# Altium schematic sheet Rectifier.SchDoc
size A4; SheetNumber: 2; SheetTotal: 3
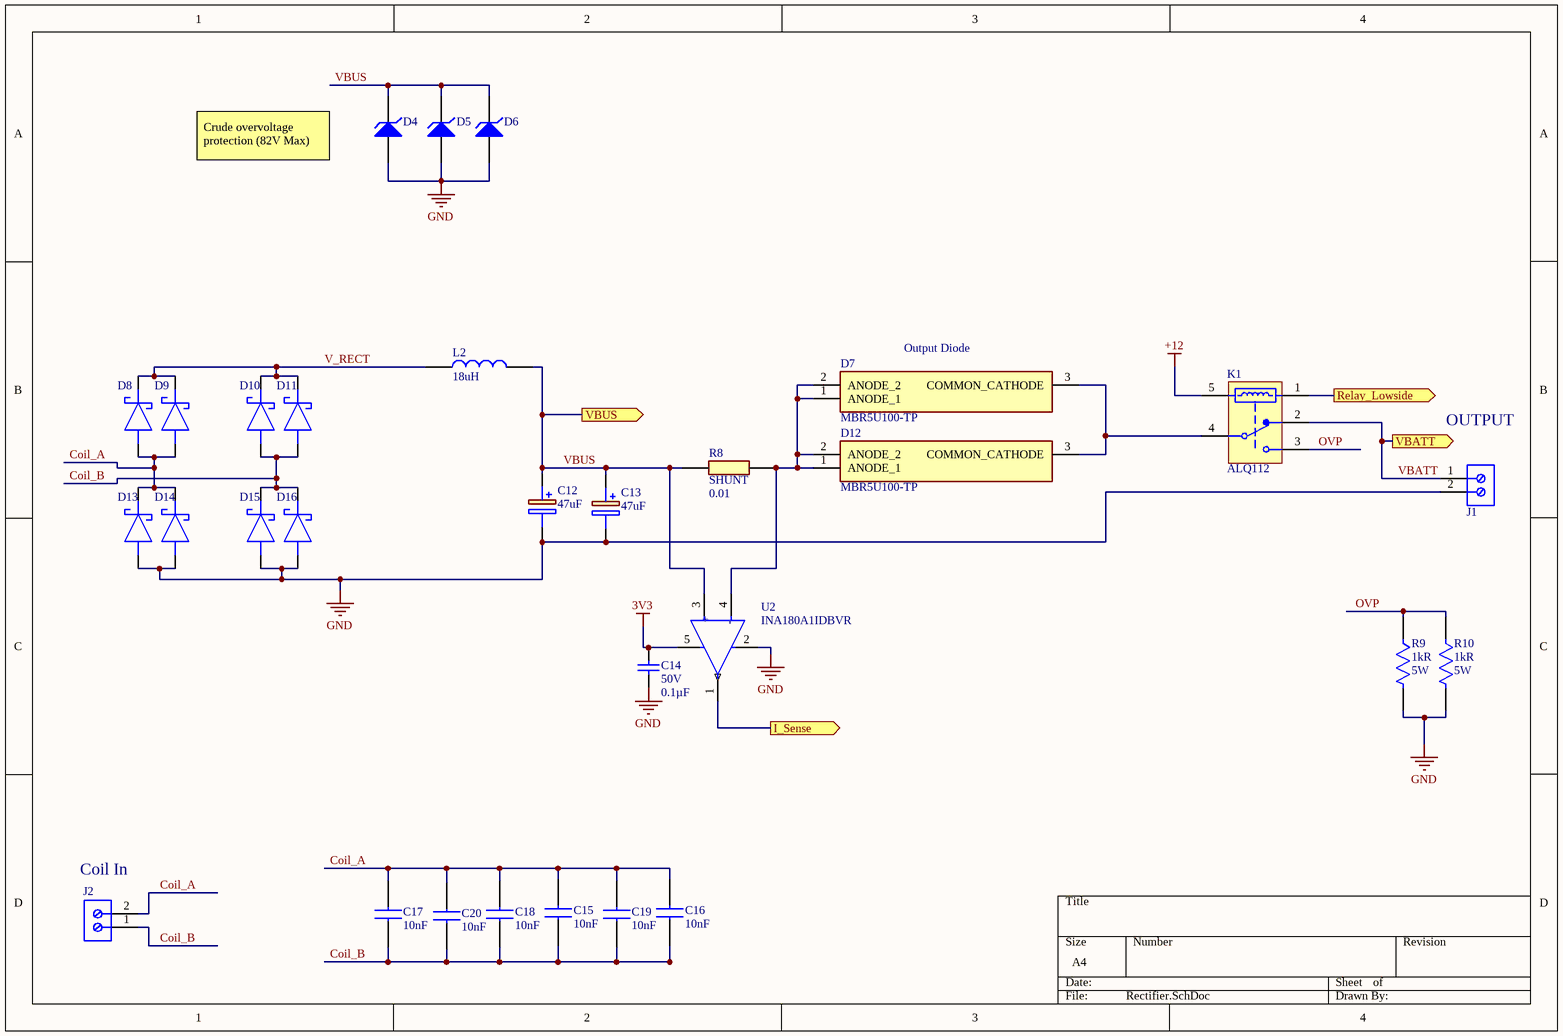
[diagram p0: Rectifier.SchDoc]

## Parts
C12  Capacitance: 47uF  [CAPAE1030X1080N]  (hidden comment: UCD1K470MNL1GS)
C13  Capacitance: 47uF  [CAPAE1030X1080N]  (hidden comment: UCD1K470MNL1GS)
C14  Voltage - Rated: 50V  Capacitance: 0.1µF  [CAP0805]  (hidden comment: C0805C104K5RACTU)
C15  Capacitance: 10nF  [CAPC3216X110N]  (hidden comment: C1206C103JAGECAUTO)
C16  Capacitance: 10nF  [CAPC3216X110N]  (hidden comment: C1206C103JAGECAUTO)
C17  Capacitance: 10nF  [CAPC3216X110N]  (hidden comment: C1206C103JAGECAUTO)
C18  Capacitance: 10nF  [CAPC3216X110N]  (hidden comment: C1206C103JAGECAUTO)
C19  Capacitance: 10nF  [CAPC3216X110N]  (hidden comment: C1206C103JAGECAUTO)
C20  Capacitance: 10nF  [CAPC3216X110N]  (hidden comment: C1206C103JAGECAUTO)
D4  1SMB5947BT3G  [ONSC-SMB-2-403A-03_H_V]  (value not drawn)
D5  1SMB5947BT3G  [ONSC-SMB-2-403A-03_H_V]  (value not drawn)
D6  1SMB5947BT3G  [ONSC-SMB-2-403A-03_H_V]  (value not drawn)
D7  MBR5U100-TP  [MBR5U100TP]
D8  STPS4S200UFN  [SODFL5436X110N]  (value not drawn)
D9  STPS4S200UFN  [SODFL5436X110N]  (value not drawn)
D10  STPS4S200UFN  [SODFL5436X110N]  (value not drawn)
D11  STPS4S200UFN  [SODFL5436X110N]  (value not drawn)
D12  MBR5U100-TP  [MBR5U100TP]
D13  STPS4S200UFN  [SODFL5436X110N]  (value not drawn)
D14  STPS4S200UFN  [SODFL5436X110N]  (value not drawn)
D15  STPS4S200UFN  [SODFL5436X110N]  (value not drawn)
D16  STPS4S200UFN  [SODFL5436X110N]  (value not drawn)
J1  691137710002  [691137710002]  (value not drawn)
J2  691137710002  [691137710002]  (value not drawn)
K1  ALQ112  [PNSC-LQ-5-2000x1000x1600_V]
L2  Inductance: 18uH  [SDR1307-220ML]  (hidden comment: SDR1307-180ML)
R8  SHUNT  Resistance: 0.01  [RESC6434X90N]
R9  Resistance: 1kR  Max Power Dissipation: 5W  [FP-SMF5-MFG]  (hidden comment: SMF51K0JT)
R10  Resistance: 1kR  Max Power Dissipation: 5W  [FP-SMF5-MFG]  (hidden comment: SMF51K0JT)
U2  INA180A1IDBVR  [FP-DBV0005A-IPC_A]

## Ports
I_Sense (out), Relay_Lowside (out), VBATT (out), VBUS (out)

## Nets
3V3: C14.2 U2.5(VS)
+12: K1.5
GND: C12.2(-) C13.2(-) C14.1 D4.2(A) D5.2(A) D6.2(A) D13.2(A) D14.2(A) D15.2(A) D16.2(A) J1.2 R9.2 R10.2 U2.2(GND)
Coil_A: C15.1 C16.1 C17.1 C18.1 C19.1 C20.1 D8.2(A) D9.2(A) D13.1(K) D14.1(K) J2.2
Coil_B: C15.2 C16.2 C17.2 C18.2 C19.2 C20.2 D10.2(A) D11.2(A) D15.1(K) D16.1(K) J2.1
I_Sense: U2.1(OUT) ; port I_Sense
OVP: K1.3(NO) R9.1 R10.1
Relay_Lowside: K1.1 ; port Relay_Lowside
V_RECT: D8.1(K) D9.1(K) D10.1(K) D11.1(K) L2.1
VBATT: J1.1 K1.2(NC) ; port VBATT
VBUS: C12.1(+) C13.1(+) D4.1(K) D5.1(K) D6.1(K) L2.2 R8.1 U2.3(IN+) ; port VBUS
NetD7_1: D7.1(ANODE_1) D7.2(ANODE_2) D12.1(ANODE_1) D12.2(ANODE_2) R8.2 U2.4(IN-)
NetD7_3: D7.3(COMMON_CATHODE) D12.3(COMMON_CATHODE) K1.4(COM)

## Notes on the sheet
- Crude overvoltage protection (82V Max)
- (near D7) Output Diode
- (near J1) OUTPUT
- (near J2) Coil In
- (in symbol CMP-04895-000140-1) +; -

## Library data of the parts
C12 C13 = UCD1K470MNL1GS: Capacitor Polarised; Manufacturer_Name: Nichicon; Datasheet Link: https://www.arrow.com/en/products/ucd1k470mnl1gs/nichicon; Height: 10.8mm; Manufacturer_Part_Number: UCD1K470MNL1GS; Mouser Part Number: 647-UCD1K470MNL1GS; Mouser Price/Stock: https://www.mouser.co.uk/ProductDetail/Nichicon/UCD1K470MNL1GS?qs=c0uEScvPYN07T8BStUenxw%3D%3D; Arrow Part Number: UCD1K470MNL1GS; Arrow Price/Stock: https://www.arrow.com/en/products/ucd1k470mnl1gs/nichicon
C14 = C0805C104K5RACTU: CAP CER 0.1UF 50V X7R 0805; Tolerance: ±10%; Supplier 1: Digi-Key; Supplier Part Number 1: 399-1170-1-ND; Temperature Coefficient: X7R; Package / Case: 0805
C15-C20 = C1206C103JAGECAUTO: Capacitor; Manufacturer_Name: KEMET; Datasheet Link: https://content.kemet.com/datasheets/KEM_C1091_C0G_ESD.pdf; Height: 1.1mm; Manufacturer_Part_Number: C1206C103JAGECAUTO; Mouser Part Number: 80-C1206C103JAGECAUT; Mouser Price/Stock: https://www.mouser.co.uk/ProductDetail/KEMET/C1206C103JAGECAUTO?qs=MLItCLRbWsxJM3Q8yxQv7A%3D%3D; Arrow Part Number: C1206C103JAGECAUTO; Arrow Price/Stock: https://www.arrow.com/en/products/c1206c103jagecauto/kemet-corporation?region=nac
D4-D6 = CMP-1060-00168-1: 3 W Zener Voltage Regulator, 2-Pin SMB, Pb-Free, Tape and Reel; Manufacturer: On Semiconductor; VZ Typ (V): 82; Mounting Technology: Surface Mount; ComponentLink1URL: http://www.onsemi.com/; ComponentLink2Description: Datasheet; PackageDescription: 2-Pin Small Molded Package, J-Bend Lead, Body 4.33 x 3.625 mm; ComponentLink3URL: http://www.onsemi.com/pub_link/Collateral/1SMB5913BT3-D.PDF; DatasheetVersion: Rev. 8; ComponentLink2URL: http://www.onsemi.com/pub_link/Collateral/1SMB5913BT3-D.PDF; PackageReference: SMB-2-403A-03_H; PartNumber: 1SMB5947BT3G; RoHS: Pb-Free; PackageVersion: Rev. H, 05/2011; ComponentLink3Description: Package Specification; ComponentLink1Description: Manufacturer URL; Packing: Tape and Reel
D7 D12 = MBR5U100-TP: Schottky Diode; Manufacturer_Name: Micro Commercial Components (MCC); Datasheet Link: https://www.mccsemi.com/pdf/Products/MBR5U100(TO-277).pdf; Height: 1.2mm; Manufacturer_Part_Number: MBR5U100-TP
D8-D11 D13-D16 = STPS4S200UFN: Schottky Diode; Manufacturer_Name: STMicroelectronics; Datasheet Link: https://www.st.com/resource/en/datasheet/stps4s200.pdf; Height: 1.1mm; Manufacturer_Part_Number: STPS4S200UFN; Mouser Part Number: 511-STPS4S200UFN; Mouser Price/Stock: https://www.mouser.co.uk/ProductDetail/STMicroelectronics/STPS4S200UFN?qs=xZ%2FP%252Ba9zWqZ%2F%2FCgto3MYYA%3D%3D; Arrow Part Number: STPS4S200UFN; Arrow Price/Stock: https://www.arrow.com/en/products/stps4s200ufn/stmicroelectronics?region=europe
J1 J2 = CMP-1502-03324-1: Series 1377 - 5.00 mm Horizontal Entry with Pressure Clamp WR-TBL, 2 pin; Manufacturer: Wurth Elektronik; Pin Number: 2; Pitch: 5.00mm; Operating Temperature: -30to120degC; Package Reference: 691137710002; Publisher: WurthElektronik; Mounting Technology: THT; Manufacturer URL: http://www.we-online.de; Packaging: Box; Part Number: 691137710002; Datasheet URL: http://katalog.we-online.de/pbs/datasheet/691137710002.pdf
K1 = CMP-1503-00193-1: LQ Relays, 12 V Coil Voltage, 400 mW Nominal Operating Power, -40 to 85 degC, 5-Pin LQ, Carton, Case, RoHS; Manufacturer: Panasonic; Pb-Free: True; Max Switching Current: 10 A (N.O.), 3 A (N.C.); Electrical Life: 5x10^4; Coil Voltage: 12 V; Max Switching Voltage: 250 V AC; Nominal Operating Power: 400 mW; Mechanical Life(Min.operation): 1x10^7; Packing: Carton, Case; ComponentLink3URL: http://www3.panasonic.biz/ac/e_download/control/relay/power/catalog/mech_eng_lq.pdf?f_cd=401220; ComponentLink1URL: http://www3.panasonic.biz/ac/ae/index.jsp; ComponentLink1Description: Manufacturer URL; Series: LQ Relays; RoHS: True; PackageReference: LQ-5-2000x1000x1600; DatasheetVersion: 201410-T; ComponentLink2Description: Datasheet; ComponentLink2URL: http://www3.panasonic.biz/ac/e_download/control/relay/power/catalog/mech_eng_lq.pdf?f_cd=401220; PackageDescription: 5-Pin Through Hole Terminal Package, Body 20 x 10 mm; PackageVersion: ASCTB92E, 10/2014; PartNumber: ALQ112; ComponentLink3Description: Package Specification; Mounting Technology: Through Hole
L2 = SDR1307-180ML: Inductor; Manufacturer_Name: Bourns; Datasheet Link: https://www.bourns.com/docs/Product-Datasheets/SDR1307.pdf; Manufacturer_Part_Number: SDR1307-180ML; Mouser Part Number: 652-SDR1307-180ML; Mouser Price/Stock: https://www.mouser.co.uk/ProductDetail/Bourns/SDR1307-180ML?qs=meVWcSOgEr47xBfFHZvpmA%3D%3D; Arrow Part Number: SDR1307-180ML; Arrow Price/Stock: https://www.arrow.com/en/products/sdr1307-180ml/bourns?region=nac
R8 = CRA2512-FZ-R010ELF: Resistor; Manufacturer_Name: Bourns; Datasheet Link: http://www.bourns.com/PDFs/CRA.pdf; Height: 0.9mm; Manufacturer_Part_Number: CRA2512-FZ-R010ELF; Mouser Part Number: 652-CRA2512FZR010ELF; Mouser Price/Stock: https://www.mouser.co.uk/ProductDetail/Bourns/CRA2512-FZ-R010ELF?qs=WqWCsLCZBkoNPiv%2FXVnYvw%3D%3D; Arrow Part Number: CRA2512-FZ-R010ELF; Arrow Price/Stock: https://www.arrow.com/en/products/cra2512-fz-r010elf/bourns
R9 R10 = CMP-03211-011405-1: RES SMD 1K OHM 5% 5W 5329; Voltage Rating: 500V; Number of Resistors: 1; Temperature Coefficient: 100ppm/°C; Number of Terminations: 2; Depth: 7.3mm; Packaging: Tape and Reel; Case/Package: SMD/SMT; Tolerance: 5%; RoHS Compliant: Yes; Resistor Type: Power resistor; Features: Flame Retardant Coating; Max Operating Temperature: 280°C; Min Operating Temperature: -80°C; Mount: Surface Mount; Series: SM; Resistance Tolerance: 5%; Height: 6.8mm; Width: 7.3mm; Technology: METAL FILM; Power Rating: 5W; Case Code (Imperial): 5328; ELV: Compliant; Radiation Hardening: No; Voltage Rating (DC): 500V; Length: 13.5mm; Termination: Solder
U2 = CMP-04895-000140-1: IC CURR SENSE 1 CIRCUIT SOT23-5; Input Bias Current: 100nA; Input Offset Voltage (Vos): 100uV; Number of Circuits: 1; Slew Rate: 2V/µs; -3db Bandwidth: 350kHz; Operating Supply Current: 260uA; Case/Package: SOT-23-5; Min Operating Temperature: -40°C; Mount: Surface Mount; Packaging: Tape and Reel; Max Operating Temperature: 125°C